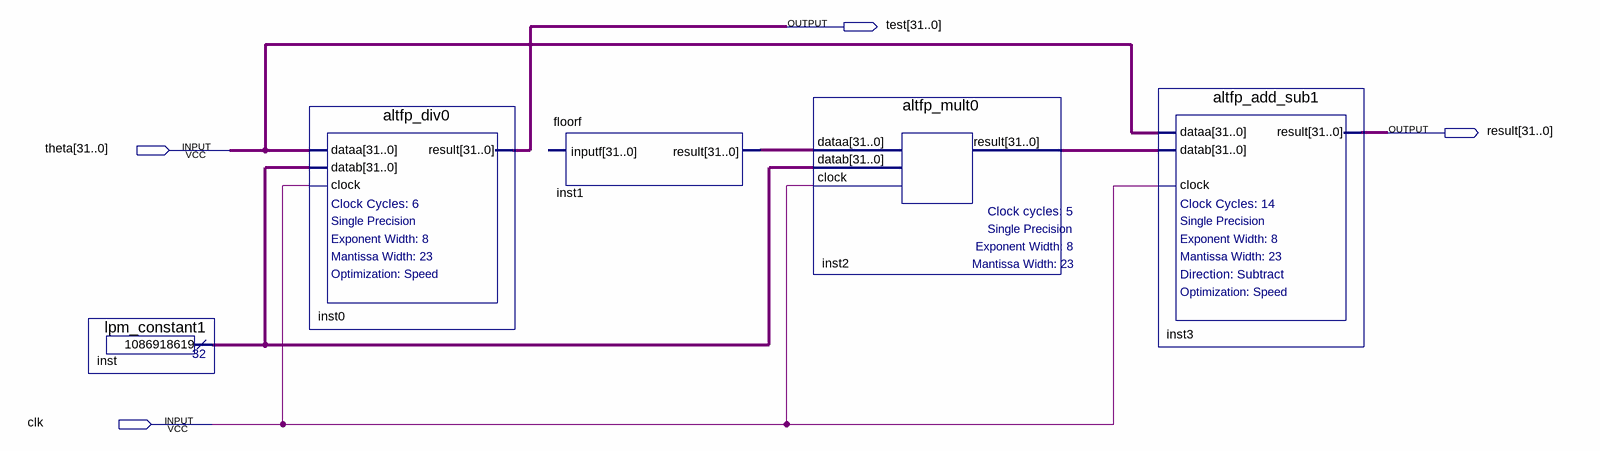
[diagram p0: schematic sheet]
// Quartus schematic normalize.bdf as structural Verilog: 5 symbols, 4 pins
module normalize (
  input  [31:0] theta,
  input  clk,
  output [31:0] test,
  output [31:0] result
);

  wire [31:0] inst1_result, inst2_result, inst_result;

  lpm_constant1 inst (.result(inst_result));
  altfp_div0 inst0 (.dataa(theta), .datab(inst_result), .clock(clk), .result(test));
  floorf inst1 (.result(inst1_result));  // open: inputf
  altfp_mult0 inst2 (.dataa(inst1_result), .datab(inst_result), .clock(clk), .result(inst2_result));
  altfp_add_sub1 inst3 (.dataa(theta), .datab(inst2_result), .clock(clk), .result(result));
endmodule
